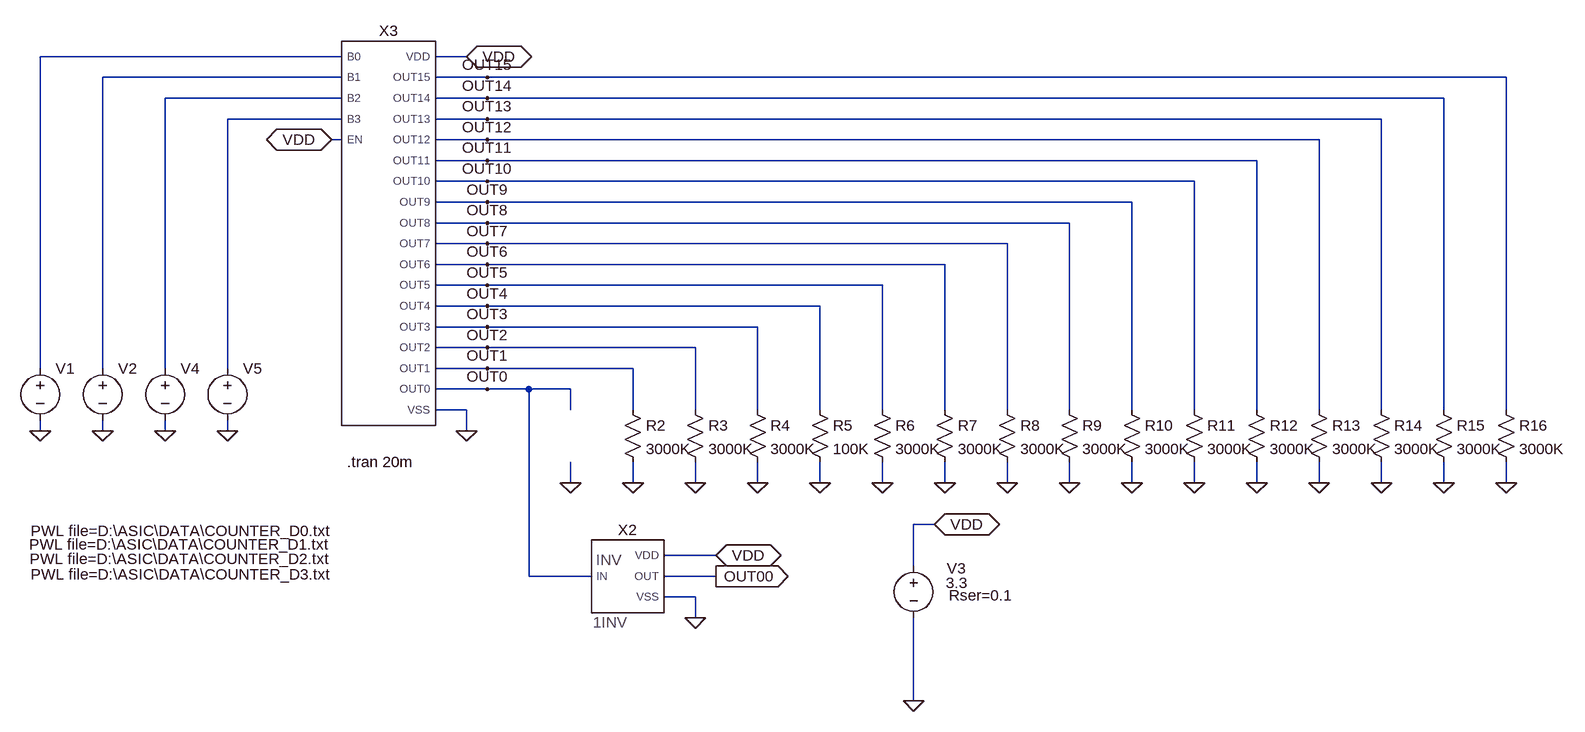
[diagram p0: schematic 4BTO16T_MUX_TEST.asc]
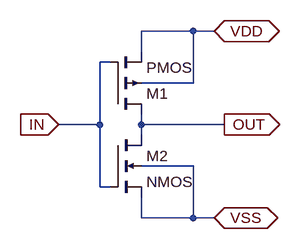
[diagram p1: sub-circuit 1inv.asc]
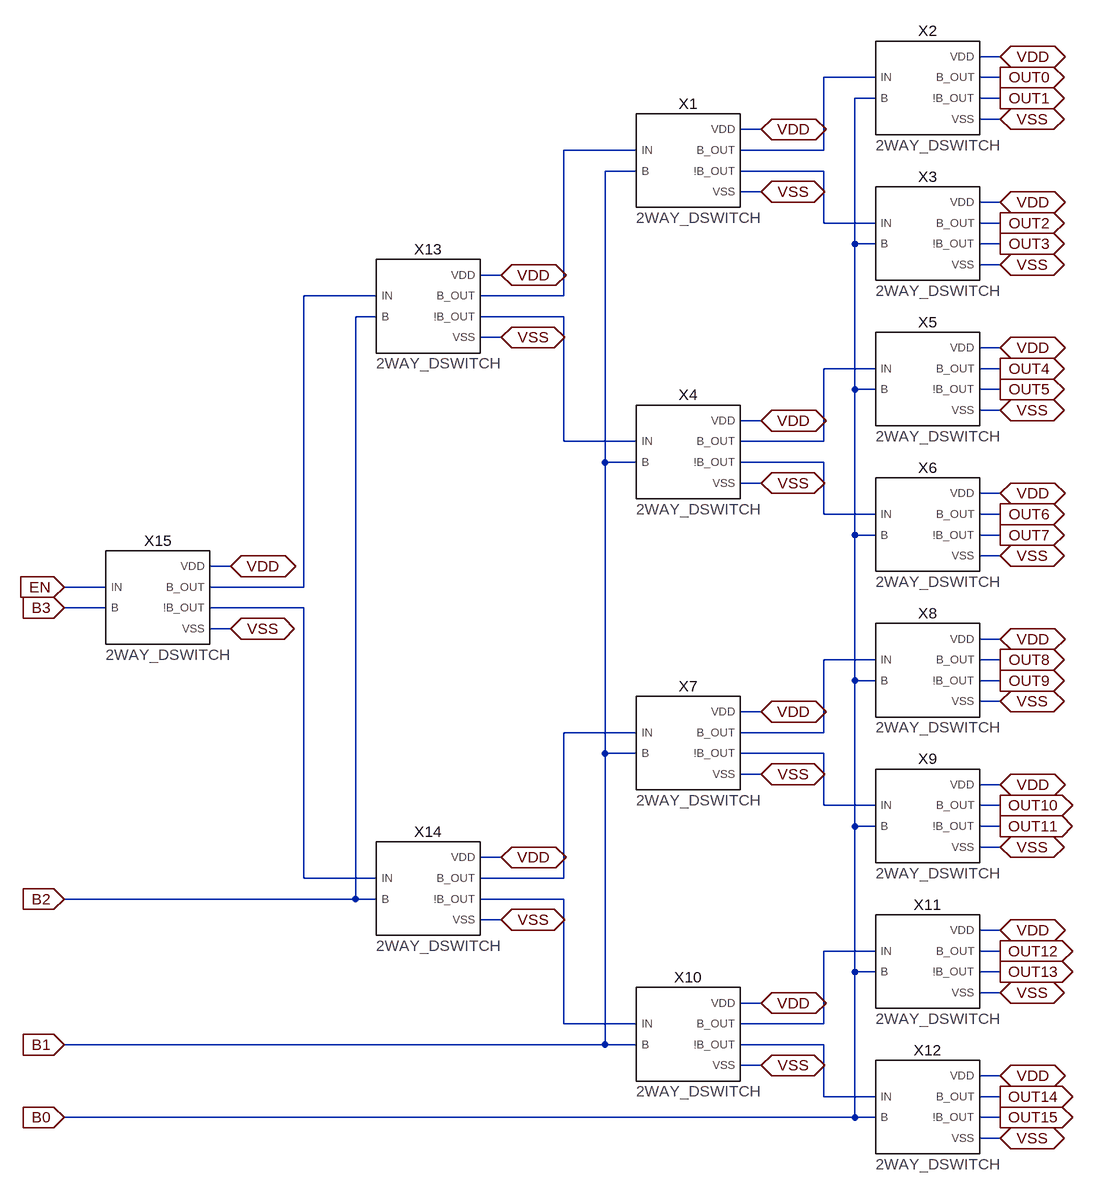
[diagram p2: sub-circuit 4bto16t_mux.asc]
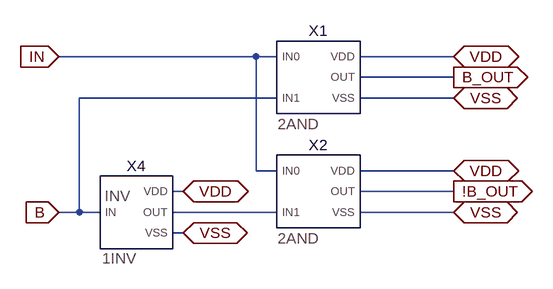
[diagram p3: sub-circuit 2way_dmux.asc]
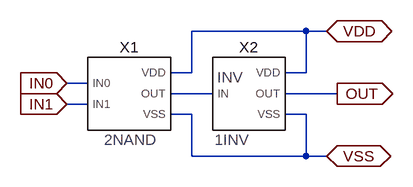
[diagram p4: sub-circuit 2and.asc]
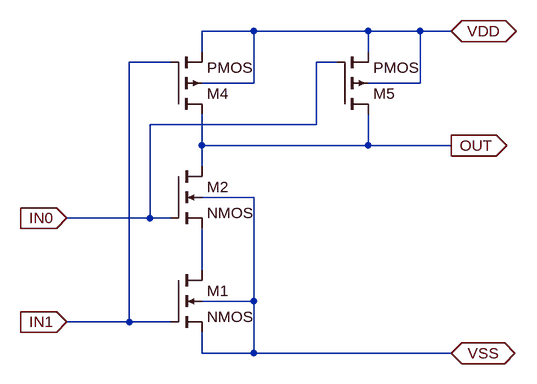
[diagram p5: sub-circuit 2nand.asc]
4BTO16T_MUX_TEST.asc, the LTspice schematic file:
Version 4
SHEET 1 2296 1184
WIRE 64 -128 -400 -128
WIRE 256 -128 208 -128
WIRE 64 -96 -304 -96
WIRE 288 -96 208 -96
WIRE 1856 -96 288 -96
WIRE 64 -64 -208 -64
WIRE 288 -64 208 -64
WIRE 1760 -64 288 -64
WIRE 64 -32 -112 -32
WIRE 288 -32 208 -32
WIRE 1664 -32 288 -32
WIRE 64 0 48 0
WIRE 288 0 208 0
WIRE 1568 0 288 0
WIRE 288 32 208 32
WIRE 1472 32 288 32
WIRE 288 64 208 64
WIRE 1376 64 288 64
WIRE 288 96 208 96
WIRE 1280 96 288 96
WIRE 288 128 208 128
WIRE 1184 128 288 128
WIRE 288 160 208 160
WIRE 1088 160 288 160
WIRE 288 192 208 192
WIRE 992 192 288 192
WIRE 288 224 208 224
WIRE 896 224 288 224
WIRE 288 256 208 256
WIRE 800 256 288 256
WIRE 288 288 208 288
WIRE 704 288 288 288
WIRE 288 320 208 320
WIRE 608 320 288 320
WIRE -400 352 -400 -128
WIRE -304 352 -304 -96
WIRE -208 352 -208 -64
WIRE -112 352 -112 -32
WIRE 288 352 208 352
WIRE 512 352 288 352
WIRE 288 384 208 384
WIRE 352 384 288 384
WIRE 416 384 352 384
WIRE 256 416 208 416
WIRE 416 416 416 384
WIRE 512 416 512 352
WIRE 608 416 608 320
WIRE 704 416 704 288
WIRE 800 416 800 256
WIRE 896 416 896 224
WIRE 992 416 992 192
WIRE 1088 416 1088 160
WIRE 1184 416 1184 128
WIRE 1280 416 1280 96
WIRE 1376 416 1376 64
WIRE 1472 416 1472 32
WIRE 1568 416 1568 0
WIRE 1664 416 1664 -32
WIRE 1760 416 1760 -64
WIRE 1856 416 1856 -96
WIRE -400 448 -400 432
WIRE -304 448 -304 432
WIRE -208 448 -208 432
WIRE -112 448 -112 432
WIRE 256 448 256 416
WIRE 416 528 416 496
WIRE 512 528 512 496
WIRE 608 528 608 496
WIRE 704 528 704 496
WIRE 800 528 800 496
WIRE 896 528 896 496
WIRE 992 528 992 496
WIRE 1088 528 1088 496
WIRE 1184 528 1184 496
WIRE 1280 528 1280 496
WIRE 1376 528 1376 496
WIRE 1472 528 1472 496
WIRE 1568 528 1568 496
WIRE 1664 528 1664 496
WIRE 1760 528 1760 496
WIRE 1856 528 1856 496
WIRE 976 592 944 592
WIRE 640 640 560 640
WIRE 944 656 944 592
WIRE 352 672 352 384
WIRE 448 672 352 672
WIRE 640 672 560 672
WIRE 608 704 560 704
WIRE 608 736 608 704
WIRE 944 864 944 736
FLAG 256 448 0
FLAG 256 -128 VDD
IOPIN 256 -128 BiDir
FLAG 944 864 0
FLAG 976 592 VDD
IOPIN 976 592 BiDir
FLAG 512 528 0
FLAG 608 528 0
FLAG 704 528 0
FLAG 800 528 0
FLAG 896 528 0
FLAG 992 528 0
FLAG 1088 528 0
FLAG 1184 528 0
FLAG 1280 528 0
FLAG 1376 528 0
FLAG 1472 528 0
FLAG 1568 528 0
FLAG 1664 528 0
FLAG 1760 528 0
FLAG 1856 528 0
FLAG 288 384 OUT0
FLAG 288 352 OUT1
FLAG 288 320 OUT2
FLAG 288 288 OUT3
FLAG 288 256 OUT4
FLAG 288 224 OUT5
FLAG 288 192 OUT6
FLAG 288 160 OUT7
FLAG 288 128 OUT8
FLAG 608 736 0
FLAG 640 640 VDD
IOPIN 640 640 BiDir
FLAG 640 672 OUT00
IOPIN 640 672 Out
FLAG 416 528 0
FLAG 48 0 VDD
IOPIN 48 0 BiDir
FLAG -400 448 0
FLAG -304 448 0
FLAG -208 448 0
FLAG -112 448 0
FLAG 288 96 OUT9
FLAG 288 64 OUT10
FLAG 288 32 OUT11
FLAG 288 0 OUT12
FLAG 288 -32 OUT13
FLAG 288 -64 OUT14
FLAG 288 -96 OUT15
SYMBOL voltage 944 640 R0
WINDOW 123 0 0 Left 2
WINDOW 39 54 61 Left 2
WINDOW 0 51 20 Left 2
WINDOW 3 50 42 Left 2
SYMATTR SpiceLine Rser=0.1
SYMATTR InstName V3
SYMATTR Value 3.3
SYMBOL res 496 400 R0
SYMATTR InstName R2
SYMATTR Value 3000K
SYMBOL res 592 400 R0
SYMATTR InstName R3
SYMATTR Value 3000K
SYMBOL res 688 400 R0
SYMATTR InstName R4
SYMATTR Value 3000K
SYMBOL res 784 400 R0
SYMATTR InstName R5
SYMATTR Value 100K
SYMBOL res 880 400 R0
SYMATTR InstName R6
SYMATTR Value 3000K
SYMBOL res 976 400 R0
SYMATTR InstName R7
SYMATTR Value 3000K
SYMBOL res 1072 400 R0
SYMATTR InstName R8
SYMATTR Value 3000K
SYMBOL res 1168 400 R0
SYMATTR InstName R9
SYMATTR Value 3000K
SYMBOL res 1264 400 R0
SYMATTR InstName R10
SYMATTR Value 3000K
SYMBOL res 1360 400 R0
SYMATTR InstName R11
SYMATTR Value 3000K
SYMBOL res 1456 400 R0
SYMATTR InstName R12
SYMATTR Value 3000K
SYMBOL res 1552 400 R0
SYMATTR InstName R13
SYMATTR Value 3000K
SYMBOL res 1648 400 R0
SYMATTR InstName R14
SYMATTR Value 3000K
SYMBOL res 1744 400 R0
SYMATTR InstName R15
SYMATTR Value 3000K
SYMBOL res 1840 400 R0
SYMATTR InstName R16
SYMATTR Value 3000K
SYMBOL 1INV 496 672 R0
SYMATTR InstName X2
SYMBOL 4BTO16T_MUX 128 144 R0
SYMATTR InstName X3
SYMBOL voltage -400 336 R0
WINDOW 3 -15 266 Left 2
WINDOW 123 0 0 Left 2
WINDOW 39 0 0 Left 2
SYMATTR Value PWL file=D:\ASIC\DATA\COUNTER_D0.txt
SYMATTR InstName V1
SYMBOL voltage -304 336 R0
WINDOW 3 -113 287 Left 2
WINDOW 123 0 0 Left 2
WINDOW 39 0 0 Left 2
SYMATTR Value PWL file=D:\ASIC\DATA\COUNTER_D1.txt
SYMATTR InstName V2
SYMBOL voltage -208 336 R0
WINDOW 3 -208 309 Left 2
WINDOW 123 0 0 Left 2
WINDOW 39 0 0 Left 2
SYMATTR Value PWL file=D:\ASIC\DATA\COUNTER_D2.txt
SYMATTR InstName V4
SYMBOL voltage -112 336 R0
WINDOW 3 -303 333 Left 2
WINDOW 123 0 0 Left 2
WINDOW 39 0 0 Left 2
SYMATTR Value PWL file=D:\ASIC\DATA\COUNTER_D3.txt
SYMATTR InstName V5
TEXT 72 496 Left 2 !.tran 20m

1inv.asc, the sub-circuit schematic file:
Version 4
SHEET 1 880 680
WIRE 224 -16 144 -16
WIRE 256 -16 224 -16
WIRE 144 16 144 -16
WIRE 96 32 80 32
WIRE 224 64 224 -16
WIRE 224 64 144 64
WIRE 80 128 80 32
WIRE 80 128 16 128
WIRE 144 128 144 112
WIRE 272 128 144 128
WIRE 144 144 144 128
WIRE 224 192 144 192
WIRE 80 224 80 128
WIRE 96 224 80 224
WIRE 144 272 144 240
WIRE 224 272 224 192
WIRE 224 272 144 272
WIRE 256 272 224 272
FLAG 16 128 IN
IOPIN 16 128 In
FLAG 272 128 OUT
IOPIN 272 128 Out
FLAG 256 -16 VDD
IOPIN 256 -16 BiDir
FLAG 256 272 VSS
IOPIN 256 272 BiDir
SYMBOL pmos4 96 112 M180
SYMATTR InstName M1
SYMATTR Value2 l=110nM w=180nM
SYMBOL nmos4 96 144 R0
SYMATTR InstName M2
SYMATTR Value2 l=110nM w=180nM

4bto16t_mux.asc, the sub-circuit schematic file:
Version 4
SHEET 1 1080 1876
WIRE 544 0 512 0
WIRE 352 32 272 32
WIRE 544 32 512 32
WIRE 352 64 320 64
WIRE 544 64 512 64
WIRE 544 96 512 96
WIRE 176 112 144 112
WIRE -16 144 -128 144
WIRE 272 144 272 32
WIRE 272 144 144 144
WIRE -16 176 -64 176
WIRE 272 176 144 176
WIRE 176 208 144 208
WIRE 544 224 512 224
WIRE 272 256 272 176
WIRE 352 256 272 256
WIRE 544 256 512 256
WIRE 320 288 320 64
WIRE 352 288 320 288
WIRE 544 288 512 288
WIRE 544 320 512 320
WIRE -224 336 -256 336
WIRE -416 368 -528 368
WIRE -128 368 -128 144
WIRE -128 368 -256 368
WIRE -416 400 -448 400
WIRE -128 400 -256 400
WIRE -224 432 -256 432
WIRE 544 448 512 448
WIRE 352 480 272 480
WIRE 544 480 512 480
WIRE 320 512 320 288
WIRE 352 512 320 512
WIRE 544 512 512 512
WIRE 544 544 512 544
WIRE 176 560 144 560
WIRE -128 592 -128 400
WIRE -16 592 -128 592
WIRE 272 592 272 480
WIRE 272 592 144 592
WIRE -64 624 -64 176
WIRE -16 624 -64 624
WIRE 272 624 144 624
WIRE 176 656 144 656
WIRE 544 672 512 672
WIRE 272 704 272 624
WIRE 352 704 272 704
WIRE 544 704 512 704
WIRE 320 736 320 512
WIRE 352 736 320 736
WIRE 544 736 512 736
WIRE 544 768 512 768
WIRE -640 784 -672 784
WIRE -832 816 -896 816
WIRE -528 816 -528 368
WIRE -528 816 -672 816
WIRE -832 848 -896 848
WIRE -528 848 -672 848
WIRE -640 880 -672 880
WIRE 544 896 512 896
WIRE 352 928 272 928
WIRE 544 928 512 928
WIRE 320 960 320 736
WIRE 352 960 320 960
WIRE 544 960 512 960
WIRE 544 992 512 992
WIRE 176 1008 144 1008
WIRE -16 1040 -128 1040
WIRE 272 1040 272 928
WIRE 272 1040 144 1040
WIRE -64 1072 -64 624
WIRE -16 1072 -64 1072
WIRE 272 1072 144 1072
WIRE 176 1104 144 1104
WIRE 544 1120 512 1120
WIRE 272 1152 272 1072
WIRE 352 1152 272 1152
WIRE 544 1152 512 1152
WIRE 320 1184 320 960
WIRE 352 1184 320 1184
WIRE 544 1184 512 1184
WIRE 544 1216 512 1216
WIRE -224 1232 -256 1232
WIRE -528 1264 -528 848
WIRE -416 1264 -528 1264
WIRE -128 1264 -128 1040
WIRE -128 1264 -256 1264
WIRE -448 1296 -448 400
WIRE -448 1296 -896 1296
WIRE -416 1296 -448 1296
WIRE -128 1296 -256 1296
WIRE -224 1328 -256 1328
WIRE 544 1344 512 1344
WIRE 352 1376 272 1376
WIRE 544 1376 512 1376
WIRE 320 1408 320 1184
WIRE 352 1408 320 1408
WIRE 544 1408 512 1408
WIRE 544 1440 512 1440
WIRE 176 1456 144 1456
WIRE -128 1488 -128 1296
WIRE -16 1488 -128 1488
WIRE 272 1488 272 1376
WIRE 272 1488 144 1488
WIRE -64 1520 -64 1072
WIRE -64 1520 -896 1520
WIRE -16 1520 -64 1520
WIRE 272 1520 144 1520
WIRE 176 1552 144 1552
WIRE 544 1568 512 1568
WIRE 272 1600 272 1520
WIRE 352 1600 272 1600
WIRE 544 1600 512 1600
WIRE 320 1632 320 1408
WIRE 320 1632 -896 1632
WIRE 352 1632 320 1632
WIRE 544 1632 512 1632
WIRE 544 1664 512 1664
FLAG 176 112 VDD
IOPIN 176 112 BiDir
FLAG 176 208 VSS
IOPIN 176 208 BiDir
FLAG 544 0 VDD
IOPIN 544 0 BiDir
FLAG 544 96 VSS
IOPIN 544 96 BiDir
FLAG 544 224 VDD
IOPIN 544 224 BiDir
FLAG 544 320 VSS
IOPIN 544 320 BiDir
FLAG 176 560 VDD
IOPIN 176 560 BiDir
FLAG 176 656 VSS
IOPIN 176 656 BiDir
FLAG 544 448 VDD
IOPIN 544 448 BiDir
FLAG 544 544 VSS
IOPIN 544 544 BiDir
FLAG 544 672 VDD
IOPIN 544 672 BiDir
FLAG 544 768 VSS
IOPIN 544 768 BiDir
FLAG 176 1008 VDD
IOPIN 176 1008 BiDir
FLAG 176 1104 VSS
IOPIN 176 1104 BiDir
FLAG 544 896 VDD
IOPIN 544 896 BiDir
FLAG 544 992 VSS
IOPIN 544 992 BiDir
FLAG 544 1120 VDD
IOPIN 544 1120 BiDir
FLAG 544 1216 VSS
IOPIN 544 1216 BiDir
FLAG 176 1456 VDD
IOPIN 176 1456 BiDir
FLAG 176 1552 VSS
IOPIN 176 1552 BiDir
FLAG 544 1344 VDD
IOPIN 544 1344 BiDir
FLAG 544 1440 VSS
IOPIN 544 1440 BiDir
FLAG 544 1568 VDD
IOPIN 544 1568 BiDir
FLAG 544 1664 VSS
IOPIN 544 1664 BiDir
FLAG 544 32 OUT0
IOPIN 544 32 Out
FLAG 544 928 OUT8
IOPIN 544 928 Out
FLAG 544 64 OUT1
IOPIN 544 64 Out
FLAG 544 256 OUT2
IOPIN 544 256 Out
FLAG 544 288 OUT3
IOPIN 544 288 Out
FLAG 544 480 OUT4
IOPIN 544 480 Out
FLAG 544 512 OUT5
IOPIN 544 512 Out
FLAG 544 704 OUT6
IOPIN 544 704 Out
FLAG 544 736 OUT7
IOPIN 544 736 Out
FLAG 544 960 OUT9
IOPIN 544 960 Out
FLAG 544 1152 OUT10
IOPIN 544 1152 Out
FLAG 544 1184 OUT11
IOPIN 544 1184 Out
FLAG 544 1376 OUT12
IOPIN 544 1376 Out
FLAG 544 1408 OUT13
IOPIN 544 1408 Out
FLAG 544 1600 OUT14
IOPIN 544 1600 Out
FLAG 544 1632 OUT15
IOPIN 544 1632 Out
FLAG -224 336 VDD
IOPIN -224 336 BiDir
FLAG -224 432 VSS
IOPIN -224 432 BiDir
FLAG -224 1232 VDD
IOPIN -224 1232 BiDir
FLAG -224 1328 VSS
IOPIN -224 1328 BiDir
FLAG -640 784 VDD
IOPIN -640 784 BiDir
FLAG -640 880 VSS
IOPIN -640 880 BiDir
FLAG -896 816 EN
IOPIN -896 816 In
FLAG -896 848 B3
IOPIN -896 848 In
FLAG -896 1296 B2
IOPIN -896 1296 In
FLAG -896 1520 B1
IOPIN -896 1520 In
FLAG -896 1632 B0
IOPIN -896 1632 In
SYMBOL 2WAY_DMUX 64 160 R0
SYMATTR InstName X1
SYMBOL 2WAY_DMUX 432 48 R0
SYMATTR InstName X2
SYMBOL 2WAY_DMUX 432 272 R0
SYMATTR InstName X3
SYMBOL 2WAY_DMUX 64 608 R0
SYMATTR InstName X4
SYMBOL 2WAY_DMUX 432 496 R0
SYMATTR InstName X5
SYMBOL 2WAY_DMUX 432 720 R0
SYMATTR InstName X6
SYMBOL 2WAY_DMUX 64 1056 R0
SYMATTR InstName X7
SYMBOL 2WAY_DMUX 432 944 R0
SYMATTR InstName X8
SYMBOL 2WAY_DMUX 432 1168 R0
SYMATTR InstName X9
SYMBOL 2WAY_DMUX 64 1504 R0
SYMATTR InstName X10
SYMBOL 2WAY_DMUX 432 1392 R0
SYMATTR InstName X11
SYMBOL 2WAY_DMUX 432 1616 R0
SYMATTR InstName X12
SYMBOL 2WAY_DMUX -336 384 R0
SYMATTR InstName X13
SYMBOL 2WAY_DMUX -336 1280 R0
SYMATTR InstName X14
SYMBOL 2WAY_DMUX -752 832 R0
SYMATTR InstName X15

2way_dmux.asc, the sub-circuit schematic file:
Version 4
SHEET 1 1108 680
WIRE 656 0 352 0
WIRE 688 0 656 0
WIRE 960 0 816 0
WIRE 960 32 816 32
WIRE 688 64 384 64
WIRE 960 64 816 64
WIRE 656 176 656 0
WIRE 688 176 656 176
WIRE 960 176 816 176
WIRE 544 208 528 208
WIRE 960 208 816 208
WIRE 384 240 384 64
WIRE 384 240 352 240
WIRE 416 240 384 240
WIRE 688 240 528 240
WIRE 960 240 816 240
WIRE 544 272 528 272
FLAG 960 32 B_OUT
IOPIN 960 32 Out
FLAG 960 208 !B_OUT
IOPIN 960 208 Out
FLAG 960 240 VSS
IOPIN 960 240 BiDir
FLAG 960 64 VSS
IOPIN 960 64 BiDir
FLAG 960 176 VDD
IOPIN 960 176 BiDir
FLAG 960 0 VDD
IOPIN 960 0 BiDir
FLAG 352 0 IN
IOPIN 352 0 In
FLAG 544 208 VDD
IOPIN 544 208 BiDir
FLAG 544 272 VSS
IOPIN 544 272 BiDir
FLAG 352 240 B
IOPIN 352 240 In
SYMBOL 1INV 464 240 R0
SYMATTR InstName X4
SYMBOL 2AND 752 32 R0
SYMATTR InstName X1
SYMBOL 2AND 752 208 R0
SYMATTR InstName X2

2and.asc, the sub-circuit schematic file:
Version 4
SHEET 1 1048 680
WIRE 656 -32 480 -32
WIRE 688 -32 656 -32
WIRE 480 32 480 -32
WIRE 480 32 448 32
WIRE 656 32 656 -32
WIRE 656 32 624 32
WIRE 320 48 288 48
WIRE 512 64 448 64
WIRE 704 64 624 64
WIRE 320 80 288 80
WIRE 480 96 448 96
WIRE 656 96 624 96
WIRE 480 160 480 96
WIRE 656 160 656 96
WIRE 656 160 480 160
WIRE 688 160 656 160
FLAG 704 64 OUT
IOPIN 704 64 Out
FLAG 688 -32 VDD
IOPIN 688 -32 BiDir
FLAG 688 160 VSS
IOPIN 688 160 BiDir
FLAG 288 48 IN0
IOPIN 288 48 In
FLAG 288 80 IN1
IOPIN 288 80 In
SYMBOL 1INV 560 64 R0
SYMATTR InstName X2
SYMBOL 2NAND 384 64 R0
SYMATTR InstName X1

2nand.asc, the sub-circuit schematic file:
Version 4
SHEET 1 880 680
WIRE 224 -224 144 -224
WIRE 400 -224 224 -224
WIRE 480 -224 400 -224
WIRE 528 -224 480 -224
WIRE 144 -192 144 -224
WIRE 400 -192 400 -224
WIRE 96 -176 32 -176
WIRE 352 -176 320 -176
WIRE 224 -144 224 -224
WIRE 224 -144 144 -144
WIRE 480 -144 480 -224
WIRE 480 -144 400 -144
WIRE 320 -80 320 -176
WIRE 320 -80 64 -80
WIRE 144 -48 144 -96
WIRE 400 -48 400 -96
WIRE 400 -48 144 -48
WIRE 528 -48 400 -48
WIRE 144 -16 144 -48
WIRE 224 32 144 32
WIRE 64 64 64 -80
WIRE 64 64 -64 64
WIRE 96 64 64 64
WIRE 144 144 144 80
WIRE 224 192 224 32
WIRE 224 192 144 192
WIRE 32 224 32 -176
WIRE 32 224 -64 224
WIRE 96 224 32 224
WIRE 144 272 144 240
WIRE 224 272 224 192
WIRE 224 272 144 272
WIRE 528 272 224 272
FLAG 528 -224 VDD
IOPIN 528 -224 BiDir
FLAG 528 272 VSS
IOPIN 528 272 BiDir
FLAG -64 64 IN0
IOPIN -64 64 In
FLAG -64 224 IN1
IOPIN -64 224 In
FLAG 528 -48 OUT
IOPIN 528 -48 Out
SYMBOL nmos4 96 144 R0
SYMATTR InstName M1
SYMATTR Value2 l=110n w=180n
SYMBOL nmos4 96 -16 R0
SYMATTR InstName M2
SYMATTR Value2 l=110n w=180n
SYMBOL pmos4 96 -96 M180
SYMATTR InstName M4
SYMATTR Value2 l=110n w=180n
SYMBOL pmos4 352 -96 M180
SYMATTR InstName M5
SYMATTR Value2 l=110n w=180n

The netlist it stands for:
* 4BTO16T_MUX_TEST.asc
V3 VDD 0 3.3 Rser=0.1
R2 OUT1 0 3000K
R3 OUT2 0 3000K
R4 OUT3 0 3000K
R5 OUT4 0 100K
R6 OUT5 0 3000K
R7 OUT6 0 3000K
R8 OUT7 0 3000K
R9 OUT8 0 3000K
R10 OUT9 0 3000K
R11 OUT10 0 3000K
R12 OUT11 0 3000K
R13 OUT12 0 3000K
R14 OUT13 0 3000K
R15 OUT14 0 3000K
R16 OUT15 0 3000K
XX2 OUT0 OUT00 VDD 0 1inv
XX3 N001 N002 N003 N004 VDD OUT0 OUT1 OUT10 OUT11 OUT12 OUT13 OUT14 OUT15 OUT2 OUT3 OUT4 OUT5 OUT6 OUT7 OUT8 OUT9 VDD 0 4bto16t_mux
V1 N001 0 PWL file=D:\ASIC\DATA\COUNTER_D0.txt
V2 N002 0 PWL file=D:\ASIC\DATA\COUNTER_D1.txt
V4 N003 0 PWL file=D:\ASIC\DATA\COUNTER_D2.txt
V5 N004 0 PWL file=D:\ASIC\DATA\COUNTER_D3.txt

* block symbol definitions
.subckt 1inv IN OUT VDD VSS
M1 OUT IN VDD VDD PMOS l=110nM w=180nM
M2 OUT IN VSS VSS NMOS l=110nM w=180nM
.ends 1inv

.subckt 4bto16t_mux B0 B1 B2 B3 EN OUT0 OUT1 OUT10 OUT11 OUT12 OUT13 OUT14 OUT15 OUT2 OUT3 OUT4 OUT5 OUT6 OUT7 OUT8 OUT9 VDD VSS
XX1 B1 N002 N003 N001 VDD VSS 2way_dmux
XX2 B0 N001 OUT1 OUT0 VDD VSS 2way_dmux
XX3 B0 N003 OUT3 OUT2 VDD VSS 2way_dmux
XX4 B1 N005 N007 N006 VDD VSS 2way_dmux
XX5 B0 N006 OUT5 OUT4 VDD VSS 2way_dmux
XX6 B0 N007 OUT7 OUT6 VDD VSS 2way_dmux
XX7 B1 N010 N011 N009 VDD VSS 2way_dmux
XX8 B0 N009 OUT9 OUT8 VDD VSS 2way_dmux
XX9 B0 N011 OUT11 OUT10 VDD VSS 2way_dmux
XX10 B1 N012 N014 N013 VDD VSS 2way_dmux
XX11 B0 N013 OUT13 OUT12 VDD VSS 2way_dmux
XX12 B0 N014 OUT15 OUT14 VDD VSS 2way_dmux
XX13 B2 N004 N005 N002 VDD VSS 2way_dmux
XX14 B2 N008 N012 N010 VDD VSS 2way_dmux
XX15 B3 EN N008 N004 VDD VSS 2way_dmux
.ends 4bto16t_mux

.subckt 2way_dmux B IN !B_OUT B_OUT VDD VSS
XX4 B N001 VDD VSS 1inv
XX1 IN B B_OUT VDD VSS 2and
XX2 IN N001 !B_OUT VDD VSS 2and
.ends 2way_dmux

.subckt 2and IN0 IN1 OUT VDD VSS
XX2 N001 OUT VDD VSS 1inv
XX1 IN0 IN1 N001 VDD VSS 2nand
.ends 2and

.subckt 2nand IN0 IN1 OUT VDD VSS
M1 N001 IN1 VSS VSS NMOS l=110n w=180n
M2 OUT IN0 N001 VSS NMOS l=110n w=180n
M4 OUT IN1 VDD VDD PMOS l=110n w=180n
M5 OUT IN0 VDD VDD PMOS l=110n w=180n
.ends 2nand

.model NMOS NMOS
.model PMOS PMOS
.lib standard.mos
.tran 20m
.backanno
.end